# EAGLE schematic PT_2015_PB_MAIN_Rev2 (EAGLE 7.2.0)
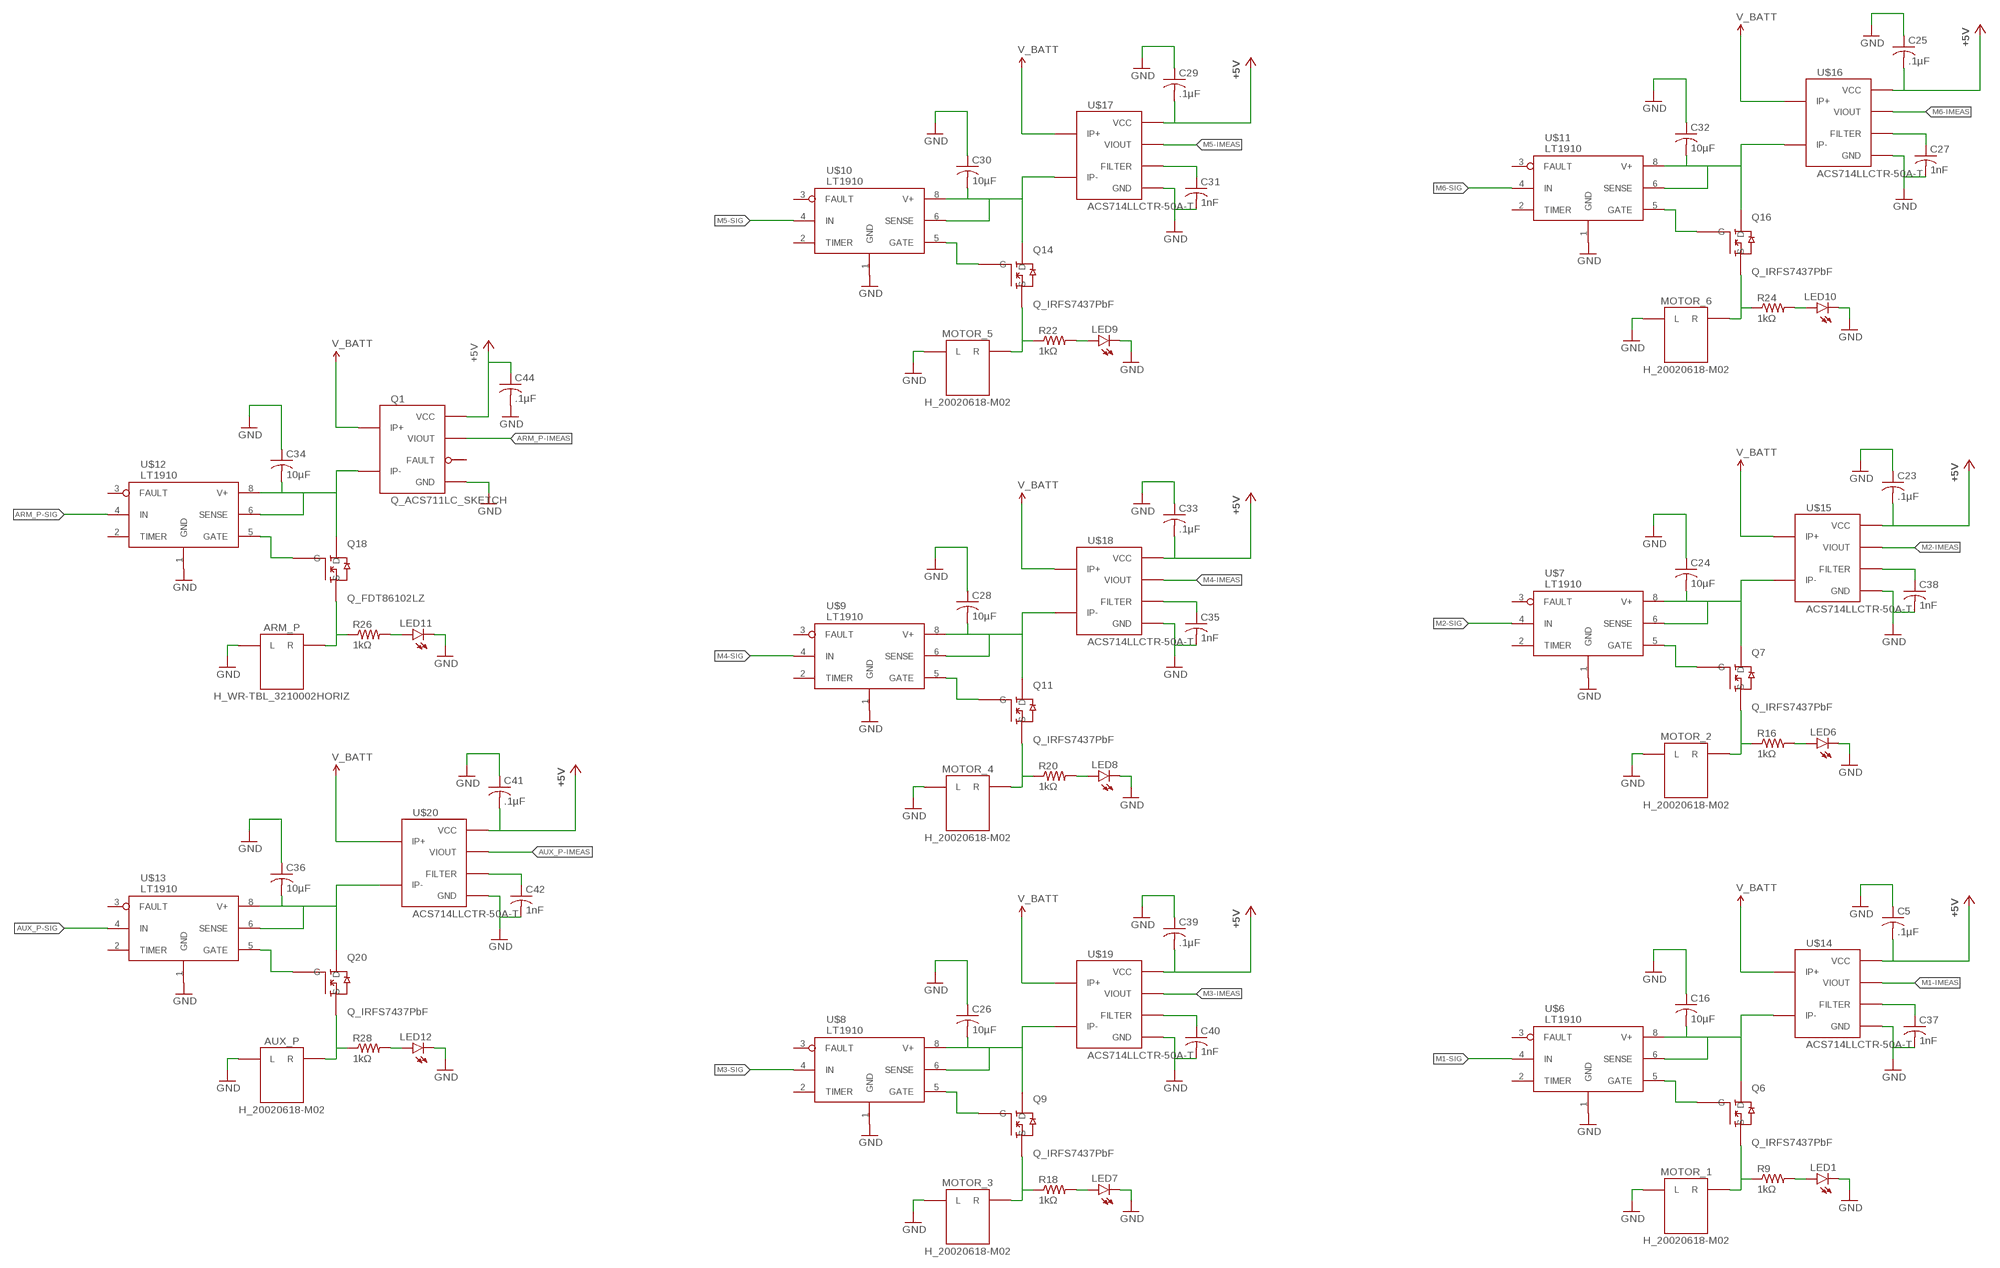
[diagram p0: schematic, sheet 1, part 1 of 3]
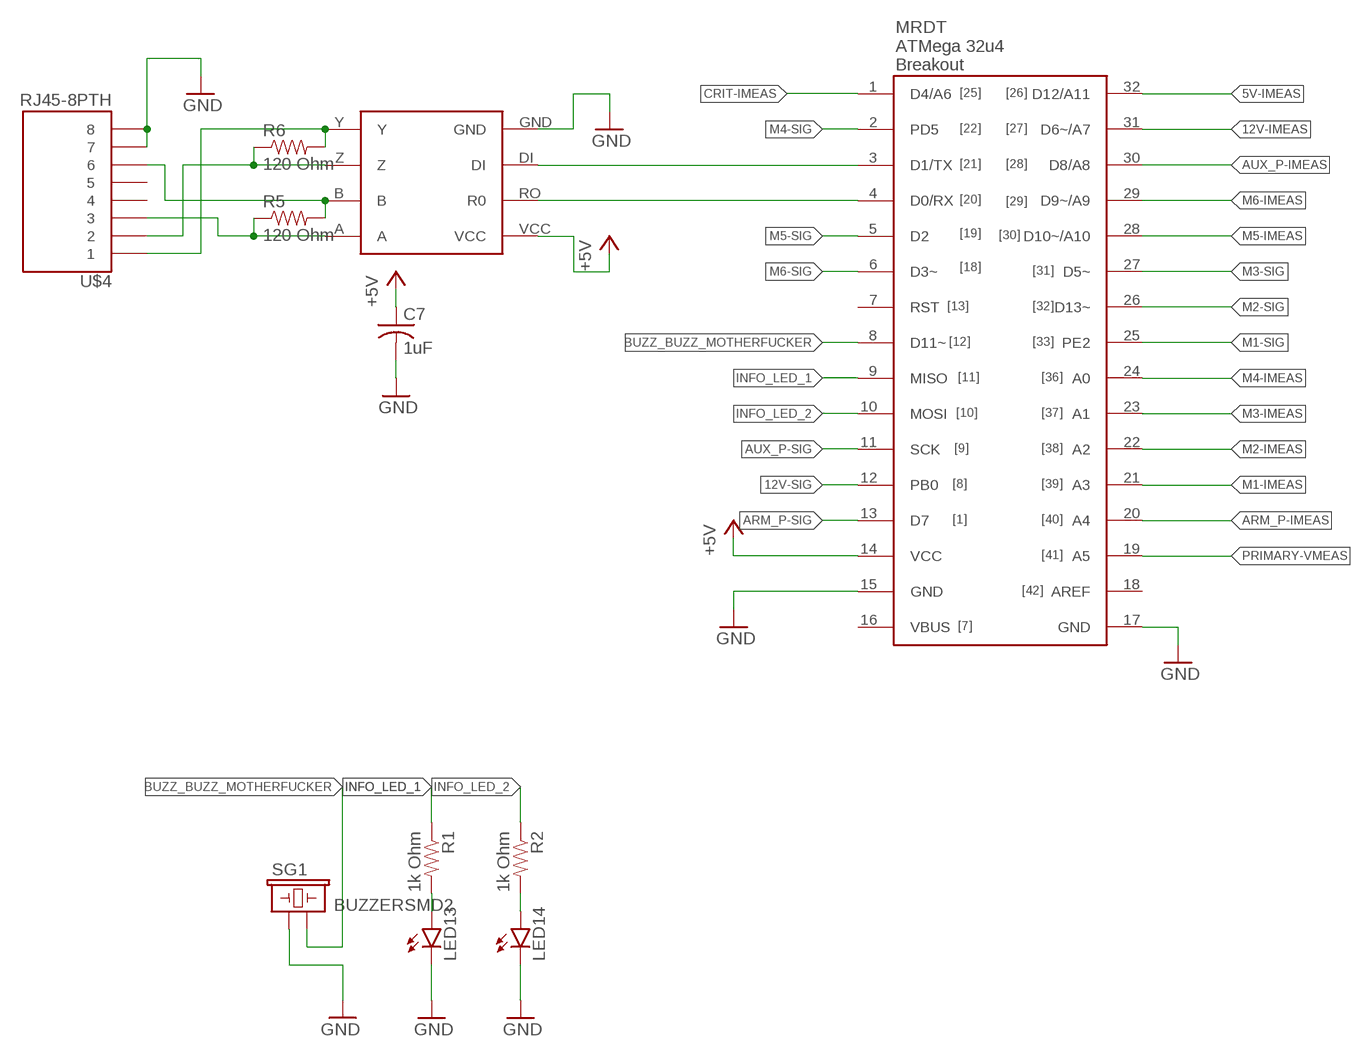
[diagram p1: schematic, sheet 1, part 2 of 3]
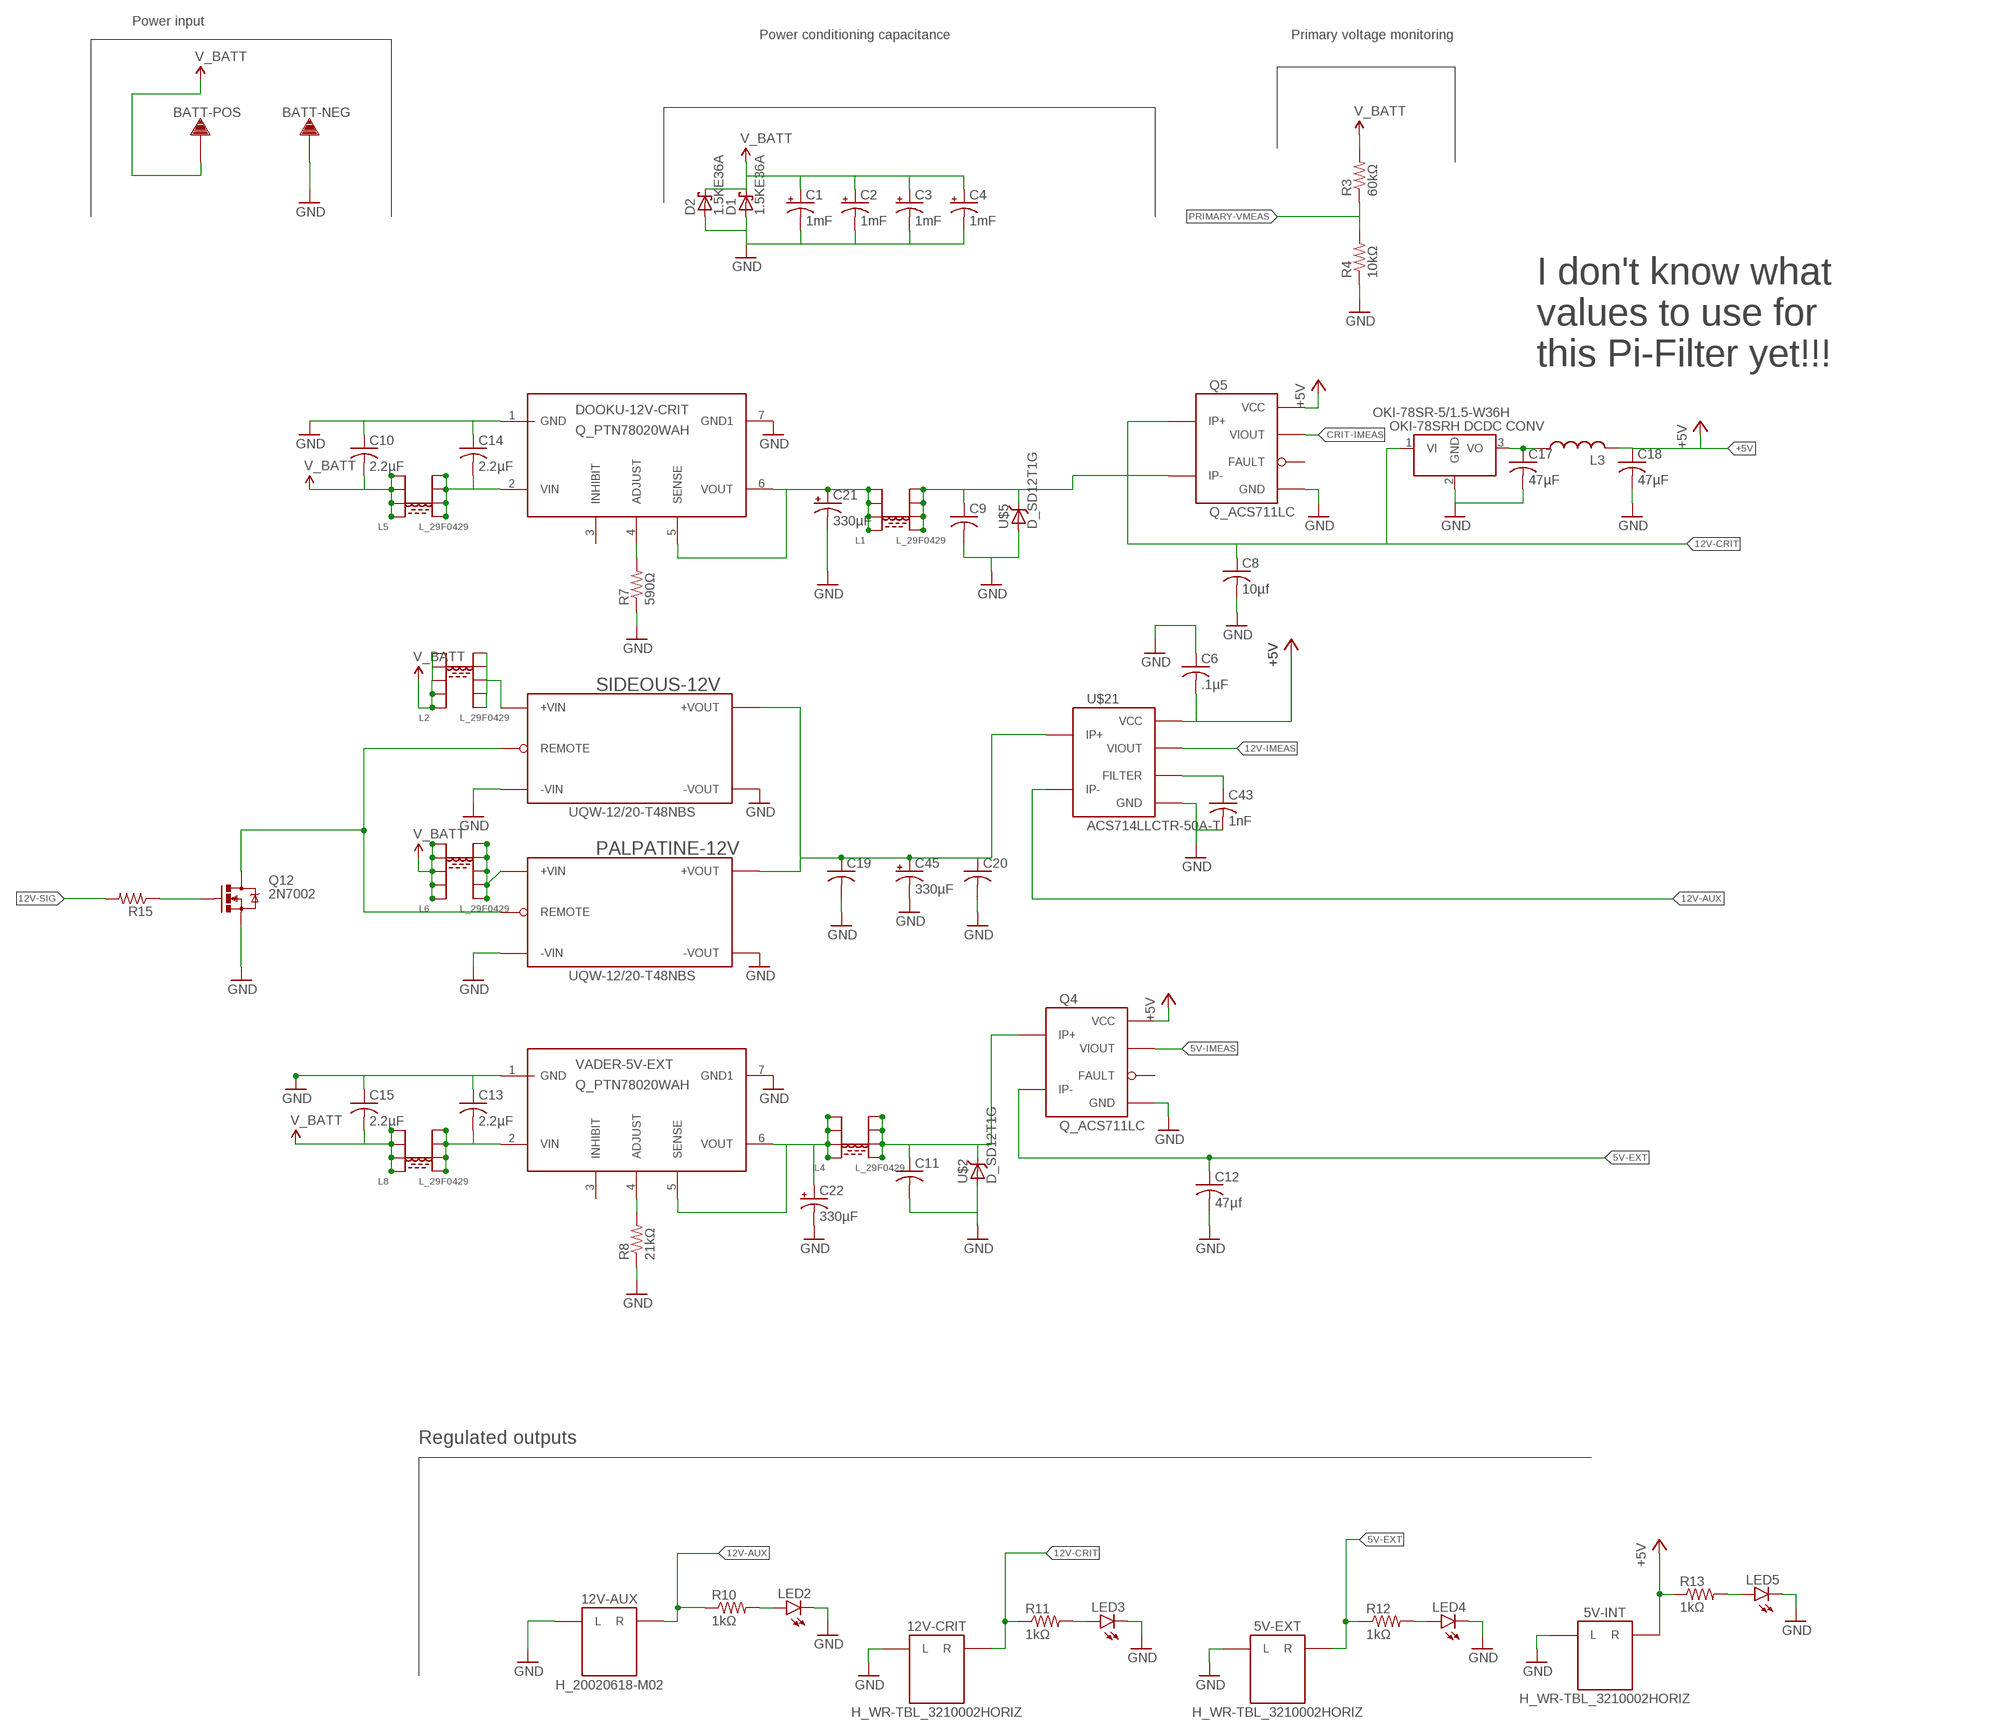
[diagram p2: schematic, sheet 1, part 3 of 3]

## Parts
5V-EXT  H_WR-TBL_3210002HORIZ  [691322110002]
5V-INT  H_WR-TBL_3210002HORIZ  [691322110002]
12V-AUX  H_20020618-M02  [20020618-M02]
12V-CRIT  H_WR-TBL_3210002HORIZ  [691322110002]
ARM_P  H_WR-TBL_3210002HORIZ  [691322110002]
AUX_P  H_20020618-M02  [20020618-M02]
BATT-NEG  TERMINAL_HOLE  [LARGE_TERMINAL_HOLE]
BATT-POS  TERMINAL_HOLE  [LARGE_TERMINAL_HOLE]
C1  1mF  C_POL12.5MM_NORMAL  [C_12.5MM]
C2  1mF  C_POL12.5MM_NORMAL  [C_12.5MM]
C3  1mF  C_POL12.5MM_NORMAL  [C_12.5MM]
C4  1mF  C_POL12.5MM_NORMAL  [C_12.5MM]
C5  .1µF  C-USC1206  [C1206]
C6  .1µF  C-USC1206  [C1206]
C7  1uF  C-USC1206  [C1206]
C8  10µf  C-USC1206  [C1206]
C9  C-USC1206  [C1206]
C10  2.2µF  C-USC1206  [C1206]
C11  C-USC1206  [C1206]
C12  47µf  C-USC1206  [C1206]
C13  2.2µF  C-USC1206  [C1206]
C14  2.2µF  C-USC1206  [C1206]
C15  2.2µF  C-USC1206  [C1206]
C16  10µF  C-USC1206  [C1206]
C17  47µF  C-USC1206  [C1206]
C18  47µF  C-USC1206  [C1206]
C19  C-USC1206  [C1206]
C20  C-USC1206  [C1206]
C21  330µF  CPOL-USE5-8.5  [E5-8,5]
C22  330µF  CPOL-USE5-8.5  [E5-8,5]
C23  .1µF  C-USC1206  [C1206]
C24  10µF  C-USC1206  [C1206]
C25  .1µF  C-USC1206  [C1206]
C26  10µF  C-USC1206  [C1206]
C27  1nF  C-USC0805  [C0805]
C28  10µF  C-USC1206  [C1206]
C29  .1µF  C-USC1206  [C1206]
C30  10µF  C-USC1206  [C1206]
C31  1nF  C-USC0805  [C0805]
C32  10µF  C-USC1206  [C1206]
C33  .1µF  C-USC1206  [C1206]
C34  10µF  C-USC1206  [C1206]
C35  1nF  C-USC0805  [C0805]
C36  10µF  C-USC1206  [C1206]
C37  1nF  C-USC0805  [C0805]
C38  1nF  C-USC0805  [C0805]
C39  .1µF  C-USC1206  [C1206]
C40  1nF  C-USC0805  [C0805]
C41  .1µF  C-USC1206  [C1206]
C42  1nF  C-USC0805  [C0805]
C43  1nF  C-USC0805  [C0805]
C44  .1µF  C-USC1206  [C1206]
C45  330µF  CPOL-USE5-8.5  [E5-8,5]
D1  1.5KE36A  15KEXX  [CB429-17]
D2  1.5KE36A  15KEXX  [CB429-17]
DOOKU-12V-CRIT  Q_PTN78020WAH  Q_PTN78020  [R_PDSS-T7]
L1  L_29F0429  [L_29F0429]
L2  L_29F0429  [L_29F0528]
L3  L-USL3216C  [L3216C]
L4  L_29F0429  [L_29F0429]
L5  L_29F0429  [L_29F0429]
L6  L_29F0429  [L_29F0528]
L8  L_29F0429  [L_29F0429]
LED1  LED1206  [LED-1206]
LED2  LED1206  [LED-1206]
LED3  LED1206  [LED-1206]
LED4  LED1206  [LED-1206]
LED5  LED1206  [LED-1206]
LED6  LED1206  [LED-1206]
LED7  LED1206  [LED-1206]
LED8  LED1206  [LED-1206]
LED9  LED1206  [LED-1206]
LED10  LED1206  [LED-1206]
LED11  LED1206  [LED-1206]
LED12  LED1206  [LED-1206]
LED13  LED-FKIT-1206  [FKIT-LED-1206]
LED14  LED-FKIT-1206  [FKIT-LED-1206]
MOTOR_1  H_20020618-M02  [20020618-M02]
MOTOR_2  H_20020618-M02  [20020618-M02]
MOTOR_3  H_20020618-M02  [20020618-M02]
MOTOR_4  H_20020618-M02  [20020618-M02]
MOTOR_5  H_20020618-M02  [20020618-M02]
MOTOR_6  H_20020618-M02  [20020618-M02]
OKI-78SR-5/1.5-W36H  Q_OKI-78SR  [OKI-78SRH]
PALPATINE-12V  UQW-12/20-T48NBS  [U-T48-QB-NO_TRIM]
Q1  Q_ACS711LC_SKETCH  [SOIC8_ACS711_SKETCH]
Q4  Q_ACS711LC  [SOIC8_ACS711]
Q5  Q_ACS711LC  [SOIC8_ACS711]
Q6  Q_IRFS7437PbF  Q_IRF7437SMD  [D2PACK]
Q7  Q_IRFS7437PbF  Q_IRF7437SMD  [D2PACK]
Q9  Q_IRFS7437PbF  Q_IRF7437SMD  [D2PACK]
Q11  Q_IRFS7437PbF  Q_IRF7437SMD  [D2PACK]
Q12  2N7002  MOSFET-NCHANNEL2N7002PW  [SOT323]
Q14  Q_IRFS7437PbF  Q_IRF7437SMD  [D2PACK]
Q16  Q_IRFS7437PbF  Q_IRF7437SMD  [D2PACK]
Q18  Q_FDT86102LZ  [SOT-223]
Q20  Q_IRFS7437PbF  Q_IRF7437SMD  [D2PACK]
R1  1k Ohm  RESISTOR1206  [1206]
R2  1k Ohm  RESISTOR1206  [1206]
R3  60kΩ  R-US_R1206  [R1206]
R4  10kΩ  R-US_R1206  [R1206]
R5  120 Ohm  RESISTOR1206  [1206]
R6  120 Ohm  RESISTOR1206  [1206]
R7  590Ω  R-US_R1206  [R1206]
R8  21kΩ  R-US_R1206  [R1206]
R9  1kΩ  RESISTOR1206  [1206]
R10  1kΩ  RESISTOR1206  [1206]
R11  1kΩ  RESISTOR1206  [1206]
R12  1kΩ  RESISTOR1206  [1206]
R13  1kΩ  RESISTOR1206  [1206]
R15  R-US_R1206  [R1206]
R16  1kΩ  RESISTOR1206  [1206]
R18  1kΩ  RESISTOR1206  [1206]
R20  1kΩ  RESISTOR1206  [1206]
R22  1kΩ  RESISTOR1206  [1206]
R24  1kΩ  RESISTOR1206  [1206]
R26  1kΩ  RESISTOR1206  [1206]
R28  1kΩ  RESISTOR1206  [1206]
SG1  BUZZERSMD2  [BUZZER-CCV]
SIDEOUS-12V  UQW-12/20-T48NBS  [U-T48-QB-NO_TRIM]
U$1  32U4_BREAKOUT  [32U4_MCU_DIP]
U$2  D_SD12T1G  [SOD-323]
U$3  MAX3077  [MAX3070E]
U$4  RJ45-8PTH  [RJ45-8]
U$5  D_SD12T1G  [SOD-323]
U$6  LT1910  [SO8]
U$7  LT1910  [SO8]
U$8  LT1910  [SO8]
U$9  LT1910  [SO8]
U$10  LT1910  [SO8]
U$11  LT1910  [SO8]
U$12  LT1910  [SO8]
U$13  LT1910  [SO8]
U$14  ACS714LLCTR-50A-T  Q_ACS714_SKETCH  [SOIC8_ACS711_SKETCH]
U$15  ACS714LLCTR-50A-T  Q_ACS714_SKETCH  [SOIC8_ACS711_SKETCH]
U$16  ACS714LLCTR-50A-T  Q_ACS714_SKETCH  [SOIC8_ACS711_SKETCH]
U$17  ACS714LLCTR-50A-T  Q_ACS714_SKETCH  [SOIC8_ACS711_SKETCH]
U$18  ACS714LLCTR-50A-T  Q_ACS714_SKETCH  [SOIC8_ACS711_SKETCH]
U$19  ACS714LLCTR-50A-T  Q_ACS714_SKETCH  [SOIC8_ACS711_SKETCH]
U$20  ACS714LLCTR-50A-T  Q_ACS714_SKETCH  [SOIC8_ACS711_SKETCH]
U$21  ACS714LLCTR-50A-T  Q_ACS714  [SOIC8_ACS711]
VADER-5V-EXT  Q_PTN78020WAH  Q_PTN78020  [R_PDSS-T7]

## Nets
5V-EXT: 5V-EXT.R C12.1 Q4.4(IP-) R12.1
5V-IMEAS: Q4.7(VIOUT) U$1.32(D12/A11)
12V-AUX: 12V-AUX.R1(R) 12V-AUX.R2(R) R10.1 U$21.4(IP-)
12V-CRIT: 12V-CRIT.R C8.1 OKI-78SR-5/1.5-W36H.1(VI) Q5.1(IP+) R11.1
12V-IMEAS: U$1.31(D6~/A7) U$21.7(VIOUT)
12V-SIG: R15.2 U$1.12(PB0)
+5V: 5V-INT.R C5.2 C6.2 C7.1 C18.1 C23.2 C25.2 C29.2 C33.2 C39.2 C41.2 C44.1 L3.2 Q1.8(VCC) Q4.8(VCC) Q5.8(VCC) R13.1 U$1.14(VCC) U$3.VCC U$14.8(VCC) U$15.8(VCC) U$16.8(VCC) U$17.8(VCC) U$18.8(VCC) U$19.8(VCC) U$20.8(VCC) U$21.8(VCC)
ARM_P-IMEAS: Q1.7(VIOUT) U$1.20(A4)
ARM_P-SIG: U$1.13(D7) U$12.4(IN)
AUX_P-IMEAS: U$1.30(D8/A8) U$20.7(VIOUT)
AUX_P-SIG: U$1.11(SCK) U$13.4(IN)
BUZZ_BUZZ_MOTHERFUCKER: SG1.- U$1.8(D11~)
CRIT-IMEAS: Q5.7(VIOUT) U$1.1(D4/A6)
GND: 5V-EXT.L 5V-INT.L 12V-AUX.L1(L) 12V-AUX.L2(L) 12V-CRIT.L ARM_P.L AUX_P.L1(L) AUX_P.L2(L) BATT-NEG.P$1 C1.- C2.- C3.- C4.- C5.1 C6.1 C7.2 C8.2 C9.2 C10.1 C11.2 C12.2 C13.1 C14.1 C15.1 C16.1 C17.2 C18.2 C19.2 C20.2 C21.- C22.- C23.1 C24.1 C25.1 C26.1 C27.2 C28.1 C29.1 C30.1 C31.2 C32.1 C33.1 C34.1 C35.2 C36.1 C37.2 C38.2 C39.1 C40.2 C41.1 C42.2 C43.2 C44.2 C45.- D1.A D2.A DOOKU-12V-CRIT.1(GND) DOOKU-12V-CRIT.7(GND1) LED1.C LED2.C LED3.C LED4.C LED5.C LED6.C LED7.C LED8.C LED9.C LED10.C LED11.C LED12.C LED13.C LED14.C MOTOR_1.L1(L) MOTOR_1.L2(L) MOTOR_2.L1(L) MOTOR_2.L2(L) MOTOR_3.L1(L) MOTOR_3.L2(L) MOTOR_4.L1(L) MOTOR_4.L2(L) MOTOR_5.L1(L) MOTOR_5.L2(L) MOTOR_6.L1(L) MOTOR_6.L2(L) OKI-78SR-5/1.5-W36H.2(GND) PALPATINE-12V.3(-VIN) PALPATINE-12V.4(-VOUT) Q1.5(GND) Q4.5(GND) Q5.5(GND) Q12.2(S) R4.1 R7.1 R8.1 SG1.+ SIDEOUS-12V.3(-VIN) SIDEOUS-12V.4(-VOUT) U$1.15(GND) U$1.17(GND) U$2.2(A) U$3.GND U$4.7 U$4.8 U$5.2(A) U$6.1(GND) U$7.1(GND) U$8.1(GND) U$9.1(GND) U$10.1(GND) U$11.1(GND) U$12.1(GND) U$13.1(GND) U$14.5(GND) U$15.5(GND) U$16.5(GND) U$17.5(GND) U$18.5(GND) U$19.5(GND) U$20.5(GND) U$21.5(GND) VADER-5V-EXT.1(GND) VADER-5V-EXT.7(GND1)
INFO_LED_1: R1.1 U$1.9(MISO)
INFO_LED_2: R2.1 U$1.10(MOSI)
M1-IMEAS: U$1.21(A3) U$14.7(VIOUT)
M1-SIG: U$1.25(PE2) U$6.4(IN)
M2-IMEAS: U$1.22(A2) U$15.7(VIOUT)
M2-SIG: U$1.26(D13~) U$7.4(IN)
M3-IMEAS: U$1.23(A1) U$19.7(VIOUT)
M3-SIG: U$1.27(D5~) U$8.4(IN)
M4-IMEAS: U$1.24(A0) U$18.7(VIOUT)
M4-SIG: U$1.2(PD5) U$9.4(IN)
M5-IMEAS: U$1.28(D10~/A10) U$17.7(VIOUT)
M5-SIG: U$1.5(D2) U$10.4(IN)
M6-IMEAS: U$1.29(D9~/A9) U$16.7(VIOUT)
M6-SIG: U$1.6(D3~) U$11.4(IN)
N$1: C37.1 U$14.6(FILTER)
N$2: C38.1 U$15.6(FILTER)
N$3: C13.2 L8.5 L8.6 L8.7 L8.8 VADER-5V-EXT.2(VIN)
N$4: PALPATINE-12V.2(REMOTE) Q12.3(D) SIDEOUS-12V.2(REMOTE)
N$5: L6.6 L6.7 L6.8 L6.9 L6.10 PALPATINE-12V.1(+VIN)
N$6: L2.6 L2.7 L2.8 L2.9 L2.10 SIDEOUS-12V.1(+VIN)
N$7: C19.1 C20.1 C45.+ PALPATINE-12V.8(+VOUT) SIDEOUS-12V.8(+VOUT) U$21.1(IP+)
N$8: C14.2 DOOKU-12V-CRIT.2(VIN) L5.5 L5.6 L5.7 L5.8
N$9: DOOKU-12V-CRIT.4(ADJUST) R7.2
N$10: C9.1 L1.5 L1.6 L1.7 L1.8 Q5.4(IP-) U$5.1(C)
N$11: LED13.A R1.2
N$12: C43.1 U$21.6(FILTER)
N$14: R6.2 U$3.Y U$4.1
N$15: C22.+ L4.1 L4.2 L4.3 L4.4 VADER-5V-EXT.5(SENSE) VADER-5V-EXT.6(VOUT)
N$16: C11.1 L4.5 L4.6 L4.7 L4.8 Q4.1(IP+) U$2.1(C)
N$17: C27.1 U$16.6(FILTER)
N$18: R6.1 U$3.Z U$4.2
N$19: R5.2 U$3.B U$4.6
N$20: R5.1 U$3.A U$4.3
N$21: U$1.3(D1/TX) U$3.DI
N$22: C31.1 U$17.6(FILTER)
N$23: C35.1 U$18.6(FILTER)
N$24: C40.1 U$19.6(FILTER)
N$25: C42.1 U$20.6(FILTER)
N$28: C24.2 Q7.TAB(D) U$7.6(SENSE) U$7.8(V+) U$15.4(IP-)
N$29: MOTOR_2.R1(R) MOTOR_2.R2(R) Q7.2(S) R16.1
N$30: Q7.1(G) U$7.5(GATE)
N$31: LED6.A R16.2
N$32: LED14.A R2.2
N$35: R8.2 VADER-5V-EXT.4(ADJUST)
N$36: C21.+ DOOKU-12V-CRIT.5(SENSE) DOOKU-12V-CRIT.6(VOUT) L1.1 L1.2 L1.3 L1.4
N$39: LED1.A R9.2
N$40: C16.2 Q6.TAB(D) U$6.6(SENSE) U$6.8(V+) U$14.4(IP-)
N$41: MOTOR_1.R1(R) MOTOR_1.R2(R) Q6.2(S) R9.1
N$42: Q6.1(G) U$6.5(GATE)
N$44: C26.2 Q9.TAB(D) U$8.6(SENSE) U$8.8(V+) U$19.4(IP-)
N$45: MOTOR_3.R1(R) MOTOR_3.R2(R) Q9.2(S) R18.1
N$46: LED2.A R10.2
N$47: Q9.1(G) U$8.5(GATE)
N$48: LED3.A R11.2
N$49: LED7.A R18.2
N$50: LED4.A R12.2
N$52: LED5.A R13.2
N$54: C28.2 Q11.TAB(D) U$9.6(SENSE) U$9.8(V+) U$18.4(IP-)
N$55: MOTOR_4.R1(R) MOTOR_4.R2(R) Q11.2(S) R20.1
N$56: Q11.1(G) U$9.5(GATE)
N$57: LED8.A R20.2
N$60: C30.2 Q14.TAB(D) U$10.6(SENSE) U$10.8(V+) U$17.4(IP-)
N$61: MOTOR_5.R1(R) MOTOR_5.R2(R) Q14.2(S) R22.1
N$62: Q14.1(G) U$10.5(GATE)
N$63: LED9.A R22.2
N$66: C32.2 Q16.TAB(D) U$11.6(SENSE) U$11.8(V+) U$16.4(IP-)
N$67: MOTOR_6.R1(R) MOTOR_6.R2(R) Q16.2(S) R24.1
N$68: Q16.1(G) U$11.5(GATE)
N$69: LED10.A R24.2
N$72: C34.2 Q1.4(IP-) Q18.2(D) Q18.4(D) U$12.6(SENSE) U$12.8(V+)
N$73: ARM_P.R Q18.3(S) R26.1
N$74: Q18.1(G) U$12.5(GATE)
N$75: LED11.A R26.2
N$78: C36.2 Q20.TAB(D) U$13.6(SENSE) U$13.8(V+) U$20.4(IP-)
N$79: AUX_P.R1(R) AUX_P.R2(R) Q20.2(S) R28.1
N$80: Q20.1(G) U$13.5(GATE)
N$81: LED12.A R28.2
N$100: C17.1 L3.1 OKI-78SR-5/1.5-W36H.3(VO)
N$114: Q12.1(G) R15.1
PRIMARY-VMEAS: R3.1 R4.2 U$1.19(A5)
RXD: U$1.4(D0/RX) U$3.RO(R0)
V_BATT: BATT-POS.P$1 C1.+ C2.+ C3.+ C4.+ C10.2 C15.2 D1.C D2.C L2.1 L2.2 L2.3 L2.4 L2.5 L5.1 L5.2 L5.3 L5.4 L6.1 L6.2 L6.3 L6.4 L6.5 L8.1 L8.2 L8.3 L8.4 Q1.1(IP+) R3.2 U$14.1(IP+) U$15.1(IP+) U$16.1(IP+) U$17.1(IP+) U$18.1(IP+) U$19.1(IP+) U$20.1(IP+)
Unconnected: DOOKU-12V-CRIT.3(INHIBIT) Q1.6(FAULT) Q4.6(FAULT) Q5.6(FAULT) U$1.7(RST) U$1.16(VBUS) U$1.18(AREF) U$4.4 U$4.5 U$6.2(TIMER) U$6.3(FAULT) U$7.2(TIMER) U$7.3(FAULT) U$8.2(TIMER) U$8.3(FAULT) U$9.2(TIMER) U$9.3(FAULT) U$10.2(TIMER) U$10.3(FAULT) U$11.2(TIMER) U$11.3(FAULT) U$12.2(TIMER) U$12.3(FAULT) U$13.2(TIMER) U$13.3(FAULT) VADER-5V-EXT.3(INHIBIT)

## Notes on the sheet
- Power input
- Power conditioning capacitance | Primary voltage monitoring
- I don't know what
  values to use for
  this Pi-Filter yet!!!
- Regulated outputs

## Library data of the parts
5V-EXT 5V-INT 12V-CRIT ARM_P = MRDT-2015-PowerBoard:H_WR-TBL_32*1*0002: Wurth Electronic's 2-pin 10A pluggable screw terminal headers. Vertical and Horizantal Part Numbers: 691322110002 (Horizantal) 691321100002 (Vertical); DIGIKEY_PN: 732-2769-ND
12V-AUX AUX_P MOTOR_1-MOTOR_6 = MRDT-2015-PowerBoard:H_20020618-M02*: 20020618-M02* header pin from FCI. Rated up to 32A
BATT-NEG BATT-POS = MRDT-2015-PowerBoard:TERMINAL_HOLE
C1-C4 = MRDT-2014-All:C_POL: Alum Elect. Cap with 10mm diameter, 5mm lead spacing and 0.7mm lead diameter
C5-C20 C23-C44 = resistor:C-US: CAPACITOR, American symbol
C21 C22 C45 = resistor:CPOL-US: POLARIZED CAPACITOR, American symbol
D1 D2 = diode:15KEXX: DIODE
DOOKU-12V-CRIT VADER-5V-EXT = MRDT-2015-PowerBoard:Q_PTN78020: TI DC/DC converter 36Vin - Adjustable output
L1 L4 L5 L8 = MRDT-2014-All:L_29F0429: Through-Hole Ferrite Bead 285 Ohm @ 100MHz
L2 L6 = MRDT-2015-PowerBoard:L_29F0429: Through-Hole Ferrite Bead 285 Ohm @ 100MHz
L3 = resistor:L-US: INDUCTOR, American symbol
LED1-LED14 = SparkFun-LED:LED: LEDs Standard schematic elements and footprints for 5mm, 3mm, 1206, and 0603 sized LEDs. 5mm - Spark Fun Electronics SKU : COM-00529 (and others)
OKI-78SR-5/1.5-W36H = MRDT-2015-PowerBoard:Q_OKI-78SR: 4.95W DC/DC Converter Manufacturer: Murata Part Number: OKI-78SR-5/1.5-W36H-C OKI-78SR-3.3/1.5-W36H-C
PALPATINE-12V SIDEOUS-12V = MRDT-2015-PowerBoard:UQW-12/20-T48NBS
Q1 Q4 Q5 = MRDT-2015-PowerBoard:Q_ACS711*LC: ±12.5A or ±25A Hall-effect current transducer. SOIC-8 Package with fused pads.
Q6 Q7 Q9 Q11 Q14 Q16 Q20 = MRDT-2015-PowerBoard:Q_IRF*7437: 40V 195A N-CH MOSFET switch with heatsink
Q12 = SparkFun-DiscreteSemi:MOSFET-NCHANNEL: Common NMOSFET Parts MFG P/N Store ID Prod ID FDD8780 TRANS-09984 SI7820DN TRANS-11055 FDS6630A IC-08089 2N7002PW TRANS-11151 FQP30N06L COM-10213 TRANS-10060 BSS123LT1G TRANS-08345 BSS138 TRANS-00830 BS170 2N7000; PROD_ID: TRANS-11151
Q18 = MRDT-2015-PowerBoard:Q_FDT86102LZ
R1 R2 R5 R6 R9-R13 R16 R18 R20 R22 R24 R26 R28 = SparkFun-Passives:RESISTOR: Resistor Basic schematic elements and footprints for 0603, 1206, and PTH resistors.
R3 R4 R7 R8 R15 = resistor:R-US_: RESISTOR, American symbol
SG1 = SparkFun-Electromechanical:BUZZER: Buzzer 12mm Spark Fun Electronics SKU : Comp-Buzzer
U$1 = MRDT-2015-General:32U4_BREAKOUT
U$2 U$5 = MRDT-2014-All:D_SD12T1G: 12V or 5V Zener
U$3 = MAX3077:MAX3077
U$4 = SparkFun-Connectors:RJ45-8: RJ45 Jack Simple RJ45, 8-pin connection - connector for common Cat5, Cat5e, and Cat6 Ethernet cables. Footprint not yet proven in production. Connector sku is PRT-00643; Breakout PCB sku is BOB-00716.
U$6-U$13 = Jake:LT1910
U$14-U$21 = MRDT-2015-PowerBoard:Q_ACS714: Sketch variant has increased clearance for traces.